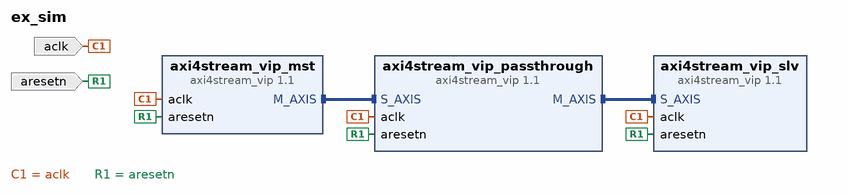
[diagram p0: block diagram of the top level]
# Vivado block design ex_sim, xc7z020clg400-2, Vivado 2018.3
create_bd_design ex_sim

create_bd_port -dir I -type clk aclk
set_property -dict [list \
  CONFIG.CLK_DOMAIN design_sim_clk_wiz_0_0_clk_out1 \
  CONFIG.FREQ_HZ 300000000 \
  CONFIG.PHASE 0.0 \
] [get_bd_ports aclk]
create_bd_port -dir I -type rst aresetn
set_property -dict {CONFIG.POLARITY ACTIVE_LOW} [get_bd_ports aresetn]

create_bd_cell -type ip -vlnv xilinx.com:ip:axi4stream_vip:1.1 axi4stream_vip_mst
set_property -dict [list \
  CONFIG.HAS_ACLKEN 0 \
  CONFIG.HAS_ARESETN 1 \
  CONFIG.HAS_TKEEP 1 \
  CONFIG.HAS_TLAST 1 \
  CONFIG.HAS_TREADY 1 \
  CONFIG.HAS_TSTRB 0 \
  CONFIG.HAS_TUSER_BITS_PER_BYTE 0 \
  CONFIG.INTERFACE_MODE MASTER \
  CONFIG.TDATA_NUM_BYTES 2 \
  CONFIG.TDEST_WIDTH 0 \
  CONFIG.TID_WIDTH 0 \
  CONFIG.TUSER_WIDTH 0 \
] [get_bd_cells axi4stream_vip_mst]
create_bd_cell -type ip -vlnv xilinx.com:ip:axi4stream_vip:1.1 axi4stream_vip_passthrough
set_property -dict [list \
  CONFIG.HAS_ACLKEN 0 \
  CONFIG.HAS_ARESETN 1 \
  CONFIG.INTERFACE_MODE PASS_THROUGH \
] [get_bd_cells axi4stream_vip_passthrough]
create_bd_cell -type ip -vlnv xilinx.com:ip:axi4stream_vip:1.1 axi4stream_vip_slv
set_property -dict {CONFIG.HAS_ACLKEN 0 CONFIG.HAS_ARESETN 1 CONFIG.INTERFACE_MODE SLAVE} [get_bd_cells axi4stream_vip_slv]

# ---- connections ----

connect_bd_intf_net [get_bd_intf_pins axi4stream_vip_slv/S_AXIS] [get_bd_intf_pins axi4stream_vip_passthrough/M_AXIS]
connect_bd_intf_net [get_bd_intf_pins axi4stream_vip_passthrough/S_AXIS] [get_bd_intf_pins axi4stream_vip_mst/M_AXIS]
connect_bd_net [get_bd_ports aclk] \
  [get_bd_pins axi4stream_vip_mst/aclk] [get_bd_pins axi4stream_vip_passthrough/aclk] [get_bd_pins axi4stream_vip_slv/aclk]
connect_bd_net [get_bd_ports aresetn] \
  [get_bd_pins axi4stream_vip_mst/aresetn] [get_bd_pins axi4stream_vip_passthrough/aresetn] \
  [get_bd_pins axi4stream_vip_slv/aresetn]

validate_bd_design
save_bd_design
